# Altium schematic sheet Zynq PS.SchDoc
size Tabloid; ApprovedBy: NA
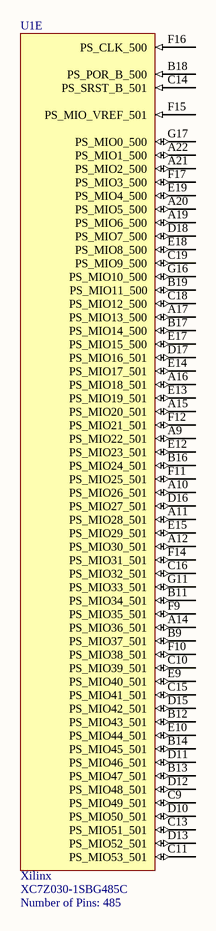
[diagram p0: Zynq PS.SchDoc]

## Parts
U1  Manufacturer: Xilinx  Manufacturer Part Number: XC7Z030-1SBG485C  Number of Pins: 485  [SBG484]  (hidden comment: U_XNLX-XC7Z030-1SBG485C)  (part E of 10)

## Nets

Not connected (* = marked no-connect by the designer): U1 A9(PS_MIO22_501) A10(PS_MIO26_501) A11(PS_MIO28_501) A12(PS_MIO30_501) A14(PS_MIO36_501) A15(PS_MIO20_501) A16(PS_MIO18_501) A17(PS_MIO13_500) A19(PS_MIO6_500) A20(PS_MIO5_500) A21(PS_MIO2_500) A22(PS_MIO1_500) B9(PS_MIO37_501) B11(PS_MIO34_501) B12(PS_MIO43_501) B13(PS_MIO47_501) B14(PS_MIO45_501) B16(PS_MIO24_501) B17(PS_MIO14_500) B18(PS_POR_B_500) B19(PS_MIO11_500) C9(PS_MIO49_501) C10(PS_MIO39_501) C11(PS_MIO53_501) C13(PS_MIO51_501) C14(PS_SRST_B_501) C15(PS_MIO41_501) C16(PS_MIO32_501) C18(PS_MIO12_500) C19(PS_MIO9_500) D10(PS_MIO50_501) D11(PS_MIO46_501) D12(PS_MIO48_501) D13(PS_MIO52_501) D15(PS_MIO42_501) D16(PS_MIO27_501) D17(PS_MIO16_501) D18(PS_MIO7_500) E9(PS_MIO40_501) E10(PS_MIO44_501) E12(PS_MIO23_501) E13(PS_MIO19_501) E14(PS_MIO17_501) E15(PS_MIO29_501) E17(PS_MIO15_500) E18(PS_MIO8_500) E19(PS_MIO4_500) F9(PS_MIO35_501) F10(PS_MIO38_501) F11(PS_MIO25_501) F12(PS_MIO21_501) F14(PS_MIO31_501) F15(PS_MIO_VREF_501) F16(PS_CLK_500) F17(PS_MIO3_500) G11(PS_MIO33_501) G16(PS_MIO10_500) G17(PS_MIO0_500)

## Notes on the sheet
- Project:
- http://www.cospandesign.com
- Cospan Design
- Document:
- Engineer:
- Title:
- Client:
- Approved By:
- Revision:
- Date:
- Number:
- of

## Library data of the parts
U1 = U_XNLX-XC7Z030-1SBG485C: MPU Zynq-7000 RISC 32-Bit 667MHz 1.5V/2V/2.5V 485-Pin FBGA; Speed Grade: -1; RAM Size: 256KB; Number of I/Os: 130; Interface: I2C,SPI,USB,CAN,Ethernet,MMC,SDIO,SD,UART,USART,EBI/EMI; Data Bus Width: 32b; Peripherals: DMA; Supplier 1: Digikey; Stock 1: 102; Pricing 1: 1=230.1 (USD); Case/Package: FBGA; Contact Plating: Copper,Tin,Silver; Min Operating Temperature: 0°C; Max Operating Temperature: 85°C; Packaging: Tray; Frequency: 667MHz; Max Frequency: 667MHz; ComponentLink1URL: https://datasheet.ciiva.com/48476/ds190-zynq-7000-overview-48476904.pdf; ComponentLink1Description: https://datasheet.ciiva.com/48476/ds190-zynq-7000-overview-48476904.pdf; Supplier Part Number 1: 122-1924-ND